# Altium schematic sheet power_monitor.SchDoc
size A; SheetNumber: 1; SheetTotal: 1
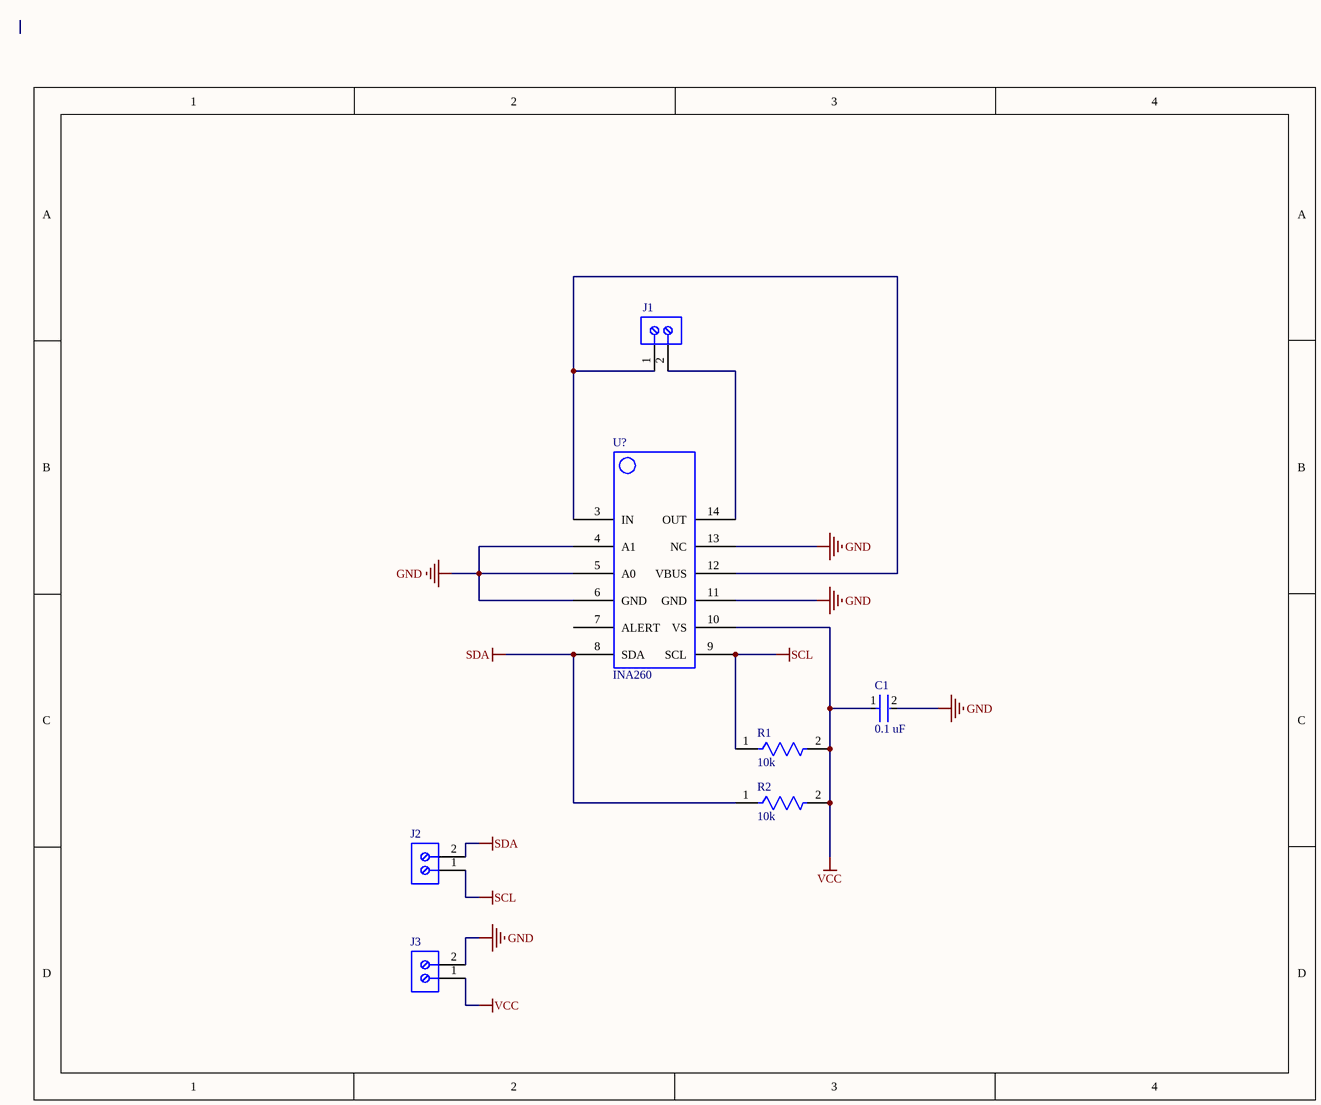
[diagram p0: power_monitor.SchDoc]

## Parts
C1  0.1 uF  [FP-CC0805-0_85-MFG]
J1  (no value)  [691137710002]
J2  (no value)  [691137710002]
J3  (no value)  [691137710002]
R1  10k  [FP-RMCF0805-MFG]
R2  10k  [FP-RMCF0805-MFG]
U?  INA260  [INA260]

## Nets
GND: C1.2 J3.2 U?.4(A1) U?.5(A0) U?.6(GND) U?.11(GND) U?.13(NC)
SCL: J2.1 R1.1 U?.9(SCL)
SDA: J2.2 R2.1 U?.8(SDA)
VCC: C1.1 J3.1 R1.2 R2.2 U?.10(VS)
NetJ1_1: J1.1 U?.3(IN) U?.12(VBUS)
NetJ1_2: J1.2 U?.14(OUT)

Not connected (* = marked no-connect by the designer): U? 7(ALERT)

## Library data of the parts
C1 = CMP-2100-03606-3: CAP CER 0.1UF 50V X7R 0805; Manufacturer Part Number: CC0805KRX7R9BB104; Manufacturer: Yageo; Tolerance: 0.1; Capacitance: 100 nF; Value: 100 nF; Description: CC0805 100 nF X7R 10.00% 50 V; Material: Ceramic; Device Class L1: Passive Components; ComponentLink2Description: Datasheet; Package: CC0805-0.85; Digikey Description: CAP CER 0.1UF 50V X7R 0805; Device Class L3: Ceramic Capacitors; Temperature: -30°C to +85°C; Temperature Characteristic: X7R; Voltage Rating: 50 V; Height: 0.95mm; RoHS: TRUE; Ipc Land Pattern Name: CAPC200125X85; Device Class L2: Capacitors; Category: Cap; Temperature Range Low: -30°C; Temperature Range High: +85°C; Mouser Description: Multilayer Ceramic Capacitors MLCC - SMD/SMT 100nF 50V X7R 10%; Footprint Url: http://www.yageo.com/exep/pages/download/literatures/UPY-C_GEN_24.pdf; Automotive: No; Octopart: https://octopart.com/cc0805krx7r9bb104-yageo-192993; Lead Free: Yes; ComponentLink2URL: http://www.yageo.com/documents/recent/UPY-GPHC_Y5V_6.3V-to-50V_8.pdf
J1-J3 = CMP-1502-03324-2: NexarPartId: 78871135; Voltage Rating: 300V; Number of Contacts: 2; Current Rating: 16A; Lead Pitch: 5mm; Height: 11.6mm; Packaging: Box; RoHS: Non-Compliant; Contact Material: Nickel, Tin; Max Operating Temperature: 120°C; Number of Pins: 2; Min Operating Temperature: -30°C; Number of Rows: 1
R1 R2 = CMP-26527-000121-1: RES 10K OHM 1% 1/8W 0805; Power Rating: 125mW; Resistance: 10kR; Temperature Coefficient: 100ppm/°C; Depth: 1.25mm; Construction: Rectangular; Packaging: Tape and Reel; Tolerance: 1%; Lead Free: Lead Free; Case/Package: 0805; RoHS Compliant: Yes; Series: RMCF; Width: 0.049inch; Max Power Dissipation: 125mW; Contact Plating: Tin; Height: 0.026inch; Mount: Surface Mount; Resistor Type: Thick Film; Size Code: 0805; Length: 2mm; Max Operating Temperature: 155°C; Features: Automotive AEC-Q200; Radiation Hardening: No; Case Code (Imperial): 0805; Min Operating Temperature: -55°C; Case Code (Metric): 2012; Number of Terminations: 2; Military Standard: Not